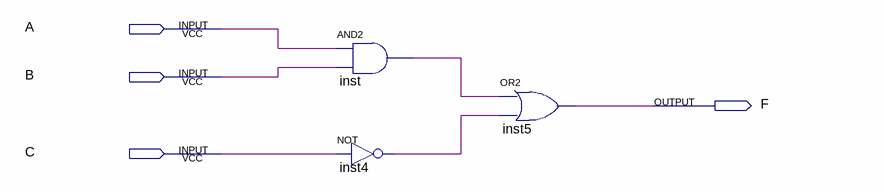
[diagram p0: schematic sheet]
// Quartus schematic test.bdf as structural Verilog: 3 symbols, 4 pins
module test (
  input  A,
  input  B,
  input  C,
  output F
);

  wire inst4_out, inst_out;

  and inst (inst_out, A, B);
  not inst4 (inst4_out, C);
  or inst5 (F, inst_out, inst4_out);
endmodule
